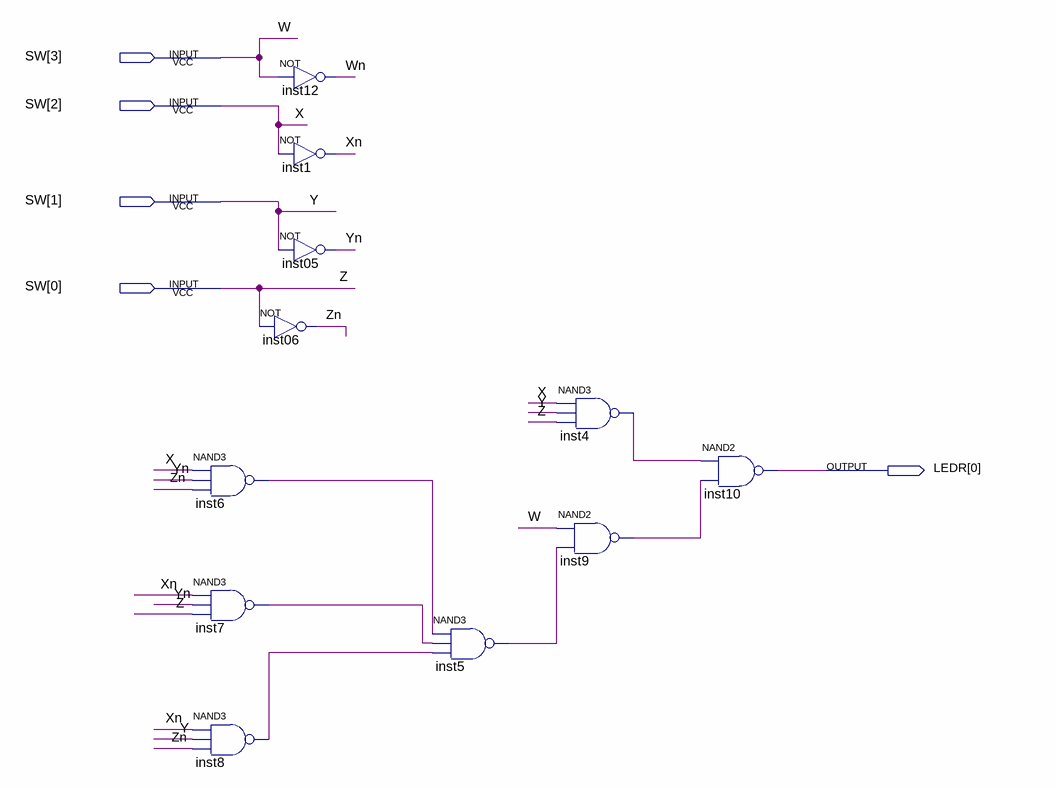
[diagram p0: schematic sheet]
// Quartus schematic NANDOnly.bdf as structural Verilog: 11 symbols, 5 pins
module NANDOnly (
  input  [3:0] SW,
  output [0:0] LEDR
);

  wire inst4_out, inst5_out, inst6_out, inst7_out, inst8_out, inst9_out, Wn, Xn, Yn, Zn;

  nand inst6 (inst6_out, SW[2], Yn, Zn);
  nand inst7 (inst7_out, Xn, Yn, SW[0]);
  nand inst8 (inst8_out, Xn, SW[1], Zn);
  not inst12 (Wn, SW[3]);
  not inst1 (Xn, SW[2]);
  not inst05 (Yn, SW[1]);
  not inst06 (Zn, SW[0]);
  nand inst5 (inst5_out, inst6_out, inst7_out, inst8_out);
  nand inst4 (inst4_out, SW[2], SW[1], SW[0]);
  nand inst9 (inst9_out, SW[3], inst5_out);
  nand inst10 (LEDR[0], inst4_out, inst9_out);

  // Other names for the same wires on the sheet: Z = SW[0]; Y = SW[1]; X = SW[2]; W = SW[3]
endmodule
